# Altium schematic sheet Sheet1.SchDoc
size A1
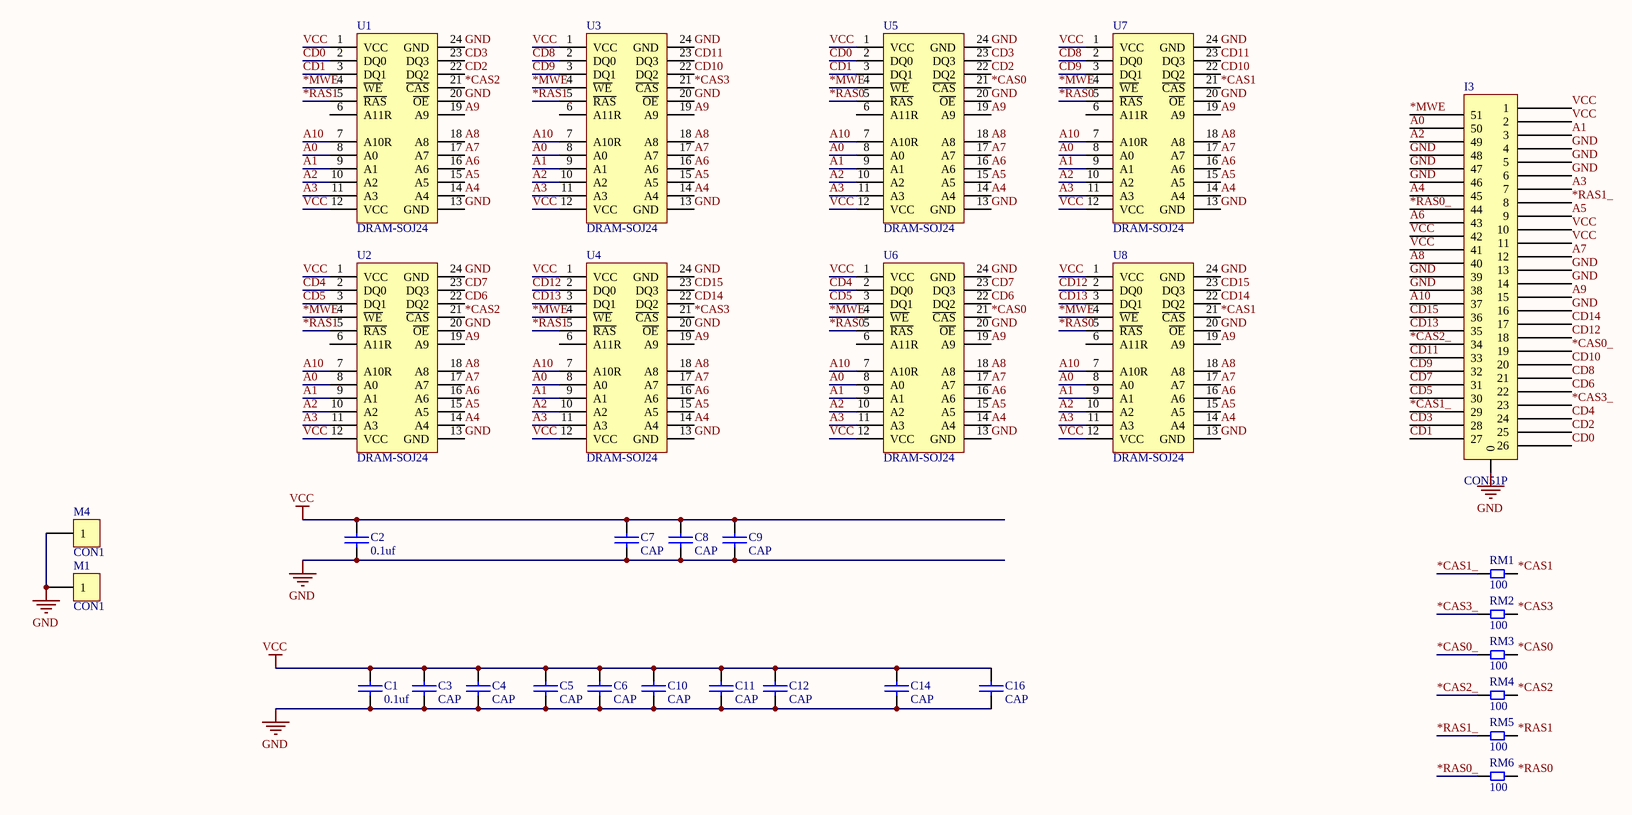
[diagram p0: Sheet1.SchDoc]

## Parts
C1  0.1uf  [C0603]
C2  0.1uf  [C0603]
C3  CAP  [C0603]
C4  CAP  [C0603]
C5  CAP  [C0603]
C6  CAP  [C0603]
C7  CAP  [C0603]
C8  CAP  [C0603]
C9  CAP  [C0603]
C10  CAP  [C0603]
C11  CAP  [C0603]
C12  CAP  [C0603]
C14  CAP  [C0603]
C16  CAP  [C0603]
I3  CON51P  [BTB1.0-51P-b]
M1  CON1  [M2A]
M4  CON1  [M2A]
RM1  100  [R0603]
RM2  100  [R0603]
RM3  100  [R0603]
RM4  100  [R0603]
RM5  100  [R0603]
RM6  100  [R0603]
U1  DRAM-SOJ24  [SOJ-24-A]
U2  DRAM-SOJ24  [SOJ-24-A]
U3  DRAM-SOJ24  [SOJ-24-A]
U4  DRAM-SOJ24  [SOJ-24-A]
U5  DRAM-SOJ24  [SOJ-24-A]
U6  DRAM-SOJ24  [SOJ-24-A]
U7  DRAM-SOJ24  [SOJ-24-A]
U8  DRAM-SOJ24  [SOJ-24-A]

## Nets
GND: C1.2 C2.2 C3.2 C4.2 C5.2 C6.2 C7.2 C8.2 C9.2 C10.2 C11.2 C12.2 C14.2 C16.2 I3.0 I3.4 I3.5 I3.6 I3.13 I3.14 I3.16 I3.38 I3.39 I3.46 I3.47 I3.48 M1.1 M4.1 U1.13(GND) U1.20(~{OE}) U1.24(GND) U2.13(GND) U2.20(~{OE}) U2.24(GND) U3.13(GND) U3.20(~{OE}) U3.24(GND) U4.13(GND) U4.20(~{OE}) U4.24(GND) U5.13(GND) U5.20(~{OE}) U5.24(GND) U6.13(GND) U6.20(~{OE}) U6.24(GND) U7.13(GND) U7.20(~{OE}) U7.24(GND) U8.13(GND) U8.20(~{OE}) U8.24(GND)
VCC: C1.1 C2.1 C3.1 C4.1 C5.1 C6.1 C7.1 C8.1 C9.1 C10.1 C11.1 C12.1 C14.1 C16.1 I3.1 I3.2 I3.10 I3.11 I3.41 I3.42 U1.1(VCC) U1.12(VCC) U2.1(VCC) U2.12(VCC) U3.1(VCC) U3.12(VCC) U4.1(VCC) U4.12(VCC) U5.1(VCC) U5.12(VCC) U6.1(VCC) U6.12(VCC) U7.1(VCC) U7.12(VCC) U8.1(VCC) U8.12(VCC)
*CAS0: RM3.2 U5.21(~{CAS}) U6.21(~{CAS})
*CAS0_: I3.19 RM3.1
*CAS1: RM1.2 U7.21(~{CAS}) U8.21(~{CAS})
*CAS1_: I3.29 RM1.1
*CAS2: RM4.2 U1.21(~{CAS}) U2.21(~{CAS})
*CAS2_: I3.34 RM4.1
*CAS3: RM2.2 U3.21(~{CAS}) U4.21(~{CAS})
*CAS3_: I3.23 RM2.1
*MWE: I3.51 U1.4(~{WE}) U2.4(~{WE}) U3.4(~{WE}) U4.4(~{WE}) U5.4(~{WE}) U6.4(~{WE}) U7.4(~{WE}) U8.4(~{WE})
*RAS0: RM6.2 U5.5(~{RAS}) U6.5(~{RAS}) U7.5(~{RAS}) U8.5(~{RAS})
*RAS0_: I3.44 RM6.1
*RAS1: RM5.2 U1.5(~{RAS}) U2.5(~{RAS}) U3.5(~{RAS}) U4.5(~{RAS})
*RAS1_: I3.8 RM5.1
A0: I3.50 U1.8(A0) U2.8(A0) U3.8(A0) U4.8(A0) U5.8(A0) U6.8(A0) U7.8(A0) U8.8(A0)
A1: I3.3 U1.9(A1) U2.9(A1) U3.9(A1) U4.9(A1) U5.9(A1) U6.9(A1) U7.9(A1) U8.9(A1)
A2: I3.49 U1.10(A2) U2.10(A2) U3.10(A2) U4.10(A2) U5.10(A2) U6.10(A2) U7.10(A2) U8.10(A2)
A3: I3.7 U1.11(A3) U2.11(A3) U3.11(A3) U4.11(A3) U5.11(A3) U6.11(A3) U7.11(A3) U8.11(A3)
A4: I3.45 U1.14(A4) U2.14(A4) U3.14(A4) U4.14(A4) U5.14(A4) U6.14(A4) U7.14(A4) U8.14(A4)
A5: I3.9 U1.15(A5) U2.15(A5) U3.15(A5) U4.15(A5) U5.15(A5) U6.15(A5) U7.15(A5) U8.15(A5)
A6: I3.43 U1.16(A6) U2.16(A6) U3.16(A6) U4.16(A6) U5.16(A6) U6.16(A6) U7.16(A6) U8.16(A6)
A7: I3.12 U1.17(A7) U2.17(A7) U3.17(A7) U4.17(A7) U5.17(A7) U6.17(A7) U7.17(A7) U8.17(A7)
A8: I3.40 U1.18(A8) U2.18(A8) U3.18(A8) U4.18(A8) U5.18(A8) U6.18(A8) U7.18(A8) U8.18(A8)
A9: I3.15 U1.19(A9) U2.19(A9) U3.19(A9) U4.19(A9) U5.19(A9) U6.19(A9) U7.19(A9) U8.19(A9)
A10: I3.37 U1.7(A10R) U2.7(A10R) U3.7(A10R) U4.7(A10R) U5.7(A10R) U6.7(A10R) U7.7(A10R) U8.7(A10R)
CD0: I3.26 U1.2(DQ0) U5.2(DQ0)
CD1: I3.27 U1.3(DQ1) U5.3(DQ1)
CD2: I3.25 U1.22(DQ2) U5.22(DQ2)
CD3: I3.28 U1.23(DQ3) U5.23(DQ3)
CD4: I3.24 U2.2(DQ0) U6.2(DQ0)
CD5: I3.30 U2.3(DQ1) U6.3(DQ1)
CD6: I3.22 U2.22(DQ2) U6.22(DQ2)
CD7: I3.31 U2.23(DQ3) U6.23(DQ3)
CD8: I3.21 U3.2(DQ0) U7.2(DQ0)
CD9: I3.32 U3.3(DQ1) U7.3(DQ1)
CD10: I3.20 U3.22(DQ2) U7.22(DQ2)
CD11: I3.33 U3.23(DQ3) U7.23(DQ3)
CD12: I3.18 U4.2(DQ0) U8.2(DQ0)
CD13: I3.35 U4.3(DQ1) U8.3(DQ1)
CD14: I3.17 U4.22(DQ2) U8.22(DQ2)
CD15: I3.36 U4.23(DQ3) U8.23(DQ3)

Not connected (* = marked no-connect by the designer): U1 6(A11R); U2 6(A11R); U3 6(A11R); U4 6(A11R); U5 6(A11R); U6 6(A11R); U7 6(A11R); U8 6(A11R)

## Library data of the parts
C1 C2 = CAP
RM1-RM6 = RES2